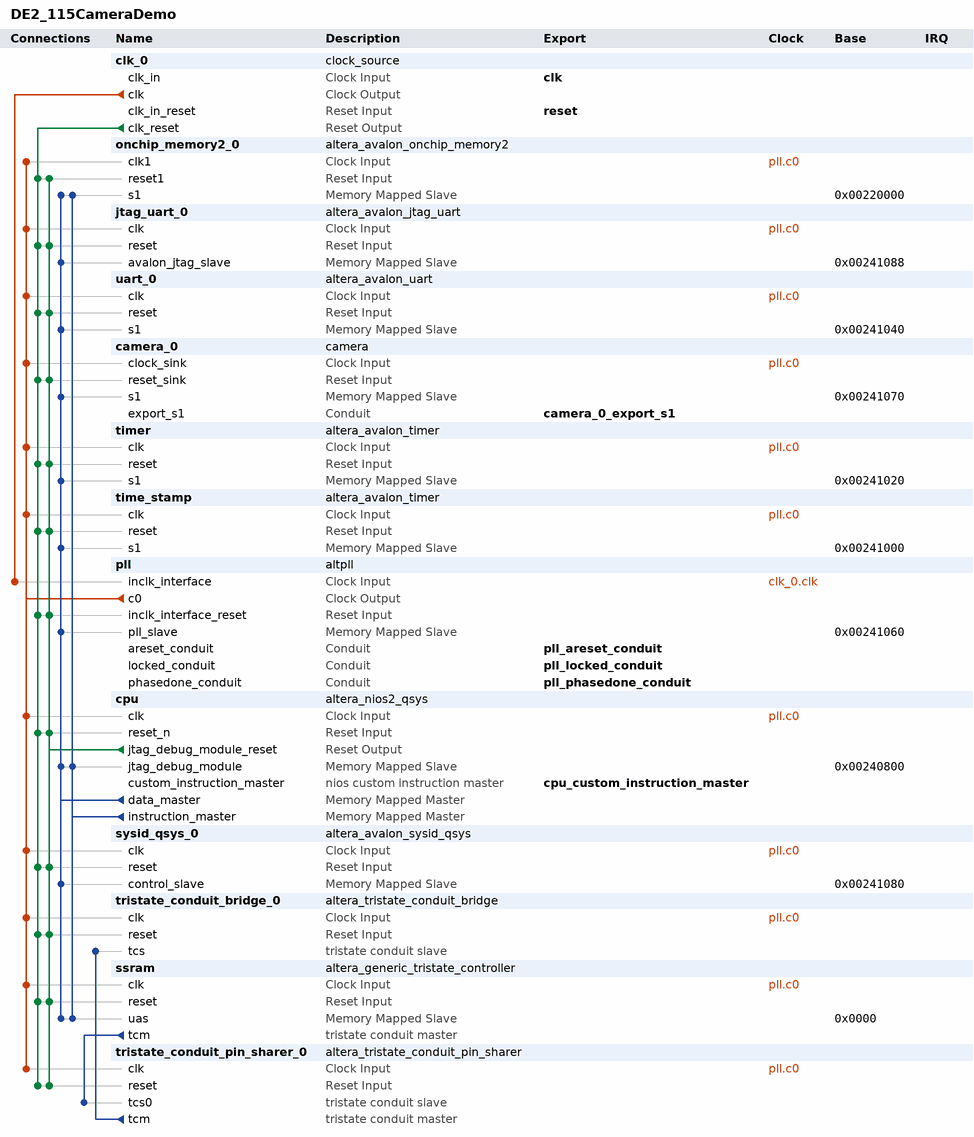
[diagram p0: system contents]
# Platform Designer (Qsys) system DE2_115CameraDemo, Cyclone IV E EP4CE115F29C7
# Parameters at their usual value, and those the tool derives, are not listed.
package require -exact qsys 13.0
create_system DE2_115CameraDemo
set_project_property DEVICE_FAMILY {Cyclone IV E}
set_project_property DEVICE EP4CE115F29C7

add_instance clk_0 clock_source 13.0
set_instance_parameter_value clk_0 clockFrequency 50000000

add_instance onchip_memory2_0 altera_avalon_onchip_memory2 13.0.1.99.2
set_instance_parameter_value onchip_memory2_0 dataWidth 32
set_instance_parameter_value onchip_memory2_0 dualPort false
set_instance_parameter_value onchip_memory2_0 initMemContent true
set_instance_parameter_value onchip_memory2_0 initializationFileName onchip_mem.hex
set_instance_parameter_value onchip_memory2_0 memorySize 92160

add_instance jtag_uart_0 altera_avalon_jtag_uart 13.0.1.99.2
set_instance_parameter_value jtag_uart_0 simInteractiveOptions NO_INTERACTIVE_WINDOWS

add_instance uart_0 altera_avalon_uart 13.0.1.99.2
set_instance_parameter_value uart_0 baud 115200
set_instance_parameter_value uart_0 dataBits 8
set_instance_parameter_value uart_0 fixedBaud true
set_instance_parameter_value uart_0 parity NONE
set_instance_parameter_value uart_0 stopBits 1
set_instance_parameter_value uart_0 useCtsRts true

add_instance camera_0 camera 1.0

add_instance timer altera_avalon_timer 13.0.1.99.2
set_instance_parameter_value timer period 1
set_instance_parameter_value timer periodUnits MSEC

add_instance time_stamp altera_avalon_timer 13.0.1.99.2
set_instance_parameter_value time_stamp period 1
set_instance_parameter_value time_stamp periodUnits MSEC

add_instance pll altpll 13.0
set_instance_parameter_value pll INCLK0_INPUT_FREQUENCY 10000
set_instance_parameter_value pll CLK0_MULTIPLY_BY 2
set_instance_parameter_value pll CLK0_DIVIDE_BY 1
set_instance_parameter_value pll PORT_clk1 PORT_UNUSED
set_instance_parameter_value pll PORT_clk2 PORT_UNUSED
set_instance_parameter_value pll PORT_clk3 PORT_UNUSED
set_instance_parameter_value pll PORT_ARESET PORT_USED
set_instance_parameter_value pll PORT_LOCKED PORT_USED

add_instance cpu altera_nios2_qsys 13.0
set_instance_parameter_value cpu resetSlave None
set_instance_parameter_value cpu mmu_TLBMissExcSlave None
set_instance_parameter_value cpu exceptionSlave None
set_instance_parameter_value cpu breakSlave cpu.jtag_debug_module
set_instance_parameter_value cpu impl Fast
set_instance_parameter_value cpu icache_size 4096

add_instance sysid_qsys_0 altera_avalon_sysid_qsys 13.0
set_instance_parameter_value sysid_qsys_0 id 0

add_instance tristate_conduit_bridge_0 altera_tristate_conduit_bridge 13.0

add_instance ssram altera_generic_tristate_controller 13.0
set_instance_parameter_value ssram TCM_ADDRESS_W 21
set_instance_parameter_value ssram TCM_DATA_W 32
set_instance_parameter_value ssram TCM_BYTEENABLE_W 4
set_instance_parameter_value ssram TCM_READ_WAIT 0
set_instance_parameter_value ssram TCM_WRITE_WAIT 0
set_instance_parameter_value ssram TCM_SETUP_WAIT 0
set_instance_parameter_value ssram TCM_DATA_HOLD 0
set_instance_parameter_value ssram TCM_MAX_PENDING_READ_TRANSACTIONS 5
set_instance_parameter_value ssram TCM_TURNAROUND_TIME 2
set_instance_parameter_value ssram TCM_TIMING_UNITS 1
set_instance_parameter_value ssram TCM_READLATENCY 4
set_instance_parameter_value ssram TCM_SYMBOLS_PER_WORD 4
set_instance_parameter_value ssram USE_READ 0
set_instance_parameter_value ssram USE_BEGINTRANSFER 1
set_instance_parameter_value ssram USE_BYTEENABLE 1
set_instance_parameter_value ssram USE_OUTPUTENABLE 1
set_instance_parameter_value ssram USE_RESET_OUTPUT 1
set_instance_parameter_value ssram ACTIVE_LOW_READ 0
set_instance_parameter_value ssram ACTIVE_LOW_BYTEENABLE 1
set_instance_parameter_value ssram ACTIVE_LOW_OUTPUTENABLE 1
set_instance_parameter_value ssram ACTIVE_LOW_BEGINTRANSFER 1
set_instance_parameter_value ssram ACTIVE_LOW_RESET_OUTPUT 1
set_instance_parameter_value ssram CHIPSELECT_THROUGH_READLATENCY 1
set_instance_parameter_value ssram MODULE_ASSIGNMENT_KEYS embeddedsw.configuration.hwClassnameDriverSupportList,embeddedsw.CMacro.SRAM_MEMORY_SIZE,embeddedsw.CMacro.SRAM_MEMORY_UNITS,embeddedsw.CMacro.SSRAM_DATA_WIDTH,embeddedsw.CMacro.SSRAM_READ_LATENCY,embeddedsw.memoryInfo.MEM_INIT_DATA_WIDTH,embeddedsw.memoryInfo.HAS_BYTE_LANE,embeddedsw.memoryInfo.GENERATE_DAT_SYM,embeddedsw.memoryInfo.DAT_SYM_INSTALL_DIR
set_instance_parameter_value ssram MODULE_ASSIGNMENT_VALUES altera_avalon_lan91c111:altera_avalon_cfi_flash,2,1048576,32,2,32,1,1,SIM_DIR
set_instance_parameter_value ssram INTERFACE_ASSIGNMENT_KEYS embeddedsw.configuration.isMemoryDevice
set_instance_parameter_value ssram INTERFACE_ASSIGNMENT_VALUES 1

add_instance tristate_conduit_pin_sharer_0 altera_tristate_conduit_pin_sharer 13.0
set_instance_parameter_value tristate_conduit_pin_sharer_0 NUM_INTERFACES 2
set_instance_parameter_value tristate_conduit_pin_sharer_0 MODULE_ORIGIN_LIST ssram.tcm,ssram.tcm,ssram.tcm,ssram.tcm,ssram.tcm,ssram.tcm,ssram.tcm,ssram.tcm
set_instance_parameter_value tristate_conduit_pin_sharer_0 SIGNAL_ORIGIN_LIST chipselect_n,byteenable_n,outputenable_n,write_n,data,address,reset_n,begintransfer_n

# connections
add_connection clk_0.clk pll.inclk_interface clock
add_connection pll.c0 camera_0.clock_sink clock
add_connection pll.c0 cpu.clk clock
add_connection pll.c0 jtag_uart_0.clk clock
add_connection pll.c0 onchip_memory2_0.clk1 clock
add_connection pll.c0 ssram.clk clock
add_connection pll.c0 sysid_qsys_0.clk clock
add_connection pll.c0 time_stamp.clk clock
add_connection pll.c0 timer.clk clock
add_connection pll.c0 tristate_conduit_bridge_0.clk clock
add_connection pll.c0 tristate_conduit_pin_sharer_0.clk clock
add_connection pll.c0 uart_0.clk clock
add_connection clk_0.clk_reset camera_0.reset_sink reset
add_connection clk_0.clk_reset cpu.reset_n reset
add_connection clk_0.clk_reset jtag_uart_0.reset reset
add_connection clk_0.clk_reset onchip_memory2_0.reset1 reset
add_connection clk_0.clk_reset pll.inclk_interface_reset reset
add_connection clk_0.clk_reset ssram.reset reset
add_connection clk_0.clk_reset sysid_qsys_0.reset reset
add_connection clk_0.clk_reset time_stamp.reset reset
add_connection clk_0.clk_reset timer.reset reset
add_connection clk_0.clk_reset tristate_conduit_bridge_0.reset reset
add_connection clk_0.clk_reset tristate_conduit_pin_sharer_0.reset reset
add_connection clk_0.clk_reset uart_0.reset reset
add_connection cpu.jtag_debug_module_reset camera_0.reset_sink reset
add_connection cpu.jtag_debug_module_reset cpu.reset_n reset
add_connection cpu.jtag_debug_module_reset jtag_uart_0.reset reset
add_connection cpu.jtag_debug_module_reset onchip_memory2_0.reset1 reset
add_connection cpu.jtag_debug_module_reset pll.inclk_interface_reset reset
add_connection cpu.jtag_debug_module_reset ssram.reset reset
add_connection cpu.jtag_debug_module_reset sysid_qsys_0.reset reset
add_connection cpu.jtag_debug_module_reset time_stamp.reset reset
add_connection cpu.jtag_debug_module_reset timer.reset reset
add_connection cpu.jtag_debug_module_reset tristate_conduit_bridge_0.reset reset
add_connection cpu.jtag_debug_module_reset tristate_conduit_pin_sharer_0.reset reset
add_connection cpu.jtag_debug_module_reset uart_0.reset reset
add_connection cpu.data_master camera_0.s1 avalon
set_connection_parameter_value cpu.data_master/camera_0.s1 baseAddress 0x00241070
add_connection cpu.data_master cpu.jtag_debug_module avalon
set_connection_parameter_value cpu.data_master/cpu.jtag_debug_module baseAddress 0x00240800
add_connection cpu.data_master jtag_uart_0.avalon_jtag_slave avalon
set_connection_parameter_value cpu.data_master/jtag_uart_0.avalon_jtag_slave baseAddress 0x00241088
add_connection cpu.data_master onchip_memory2_0.s1 avalon
set_connection_parameter_value cpu.data_master/onchip_memory2_0.s1 baseAddress 0x00220000
add_connection cpu.data_master pll.pll_slave avalon
set_connection_parameter_value cpu.data_master/pll.pll_slave baseAddress 0x00241060
add_connection cpu.data_master ssram.uas avalon
set_connection_parameter_value cpu.data_master/ssram.uas baseAddress 0x0000
add_connection cpu.data_master sysid_qsys_0.control_slave avalon
set_connection_parameter_value cpu.data_master/sysid_qsys_0.control_slave baseAddress 0x00241080
add_connection cpu.data_master time_stamp.s1 avalon
set_connection_parameter_value cpu.data_master/time_stamp.s1 baseAddress 0x00241000
add_connection cpu.data_master timer.s1 avalon
set_connection_parameter_value cpu.data_master/timer.s1 baseAddress 0x00241020
add_connection cpu.data_master uart_0.s1 avalon
set_connection_parameter_value cpu.data_master/uart_0.s1 baseAddress 0x00241040
add_connection cpu.instruction_master cpu.jtag_debug_module avalon
set_connection_parameter_value cpu.instruction_master/cpu.jtag_debug_module baseAddress 0x00240800
add_connection cpu.instruction_master onchip_memory2_0.s1 avalon
set_connection_parameter_value cpu.instruction_master/onchip_memory2_0.s1 baseAddress 0x00220000
add_connection cpu.instruction_master ssram.uas avalon
set_connection_parameter_value cpu.instruction_master/ssram.uas baseAddress 0x0000
add_connection ssram.tcm tristate_conduit_pin_sharer_0.tcs0 tristate_conduit
add_connection tristate_conduit_pin_sharer_0.tcm tristate_conduit_bridge_0.tcs tristate_conduit

# exported interfaces
add_interface clk clock sink
set_interface_property clk EXPORT_OF clk_0.clk_in
add_interface reset reset sink
set_interface_property reset EXPORT_OF clk_0.clk_in_reset
add_interface camera_0_export_s1 conduit end
set_interface_property camera_0_export_s1 EXPORT_OF camera_0.export_s1
add_interface pll_locked_conduit conduit end
set_interface_property pll_locked_conduit EXPORT_OF pll.locked_conduit
add_interface pll_phasedone_conduit conduit end
set_interface_property pll_phasedone_conduit EXPORT_OF pll.phasedone_conduit
add_interface pll_areset_conduit conduit end
set_interface_property pll_areset_conduit EXPORT_OF pll.areset_conduit
add_interface cpu_custom_instruction_master nios_custom_instruction start
set_interface_property cpu_custom_instruction_master EXPORT_OF cpu.custom_instruction_master

set_interconnect_requirement {$system} qsys_mm.clockCrossingAdapter HANDSHAKE
set_interconnect_requirement {$system} qsys_mm.maxAdditionalLatency 1

save_system DE2_115CameraDemo.qsys
